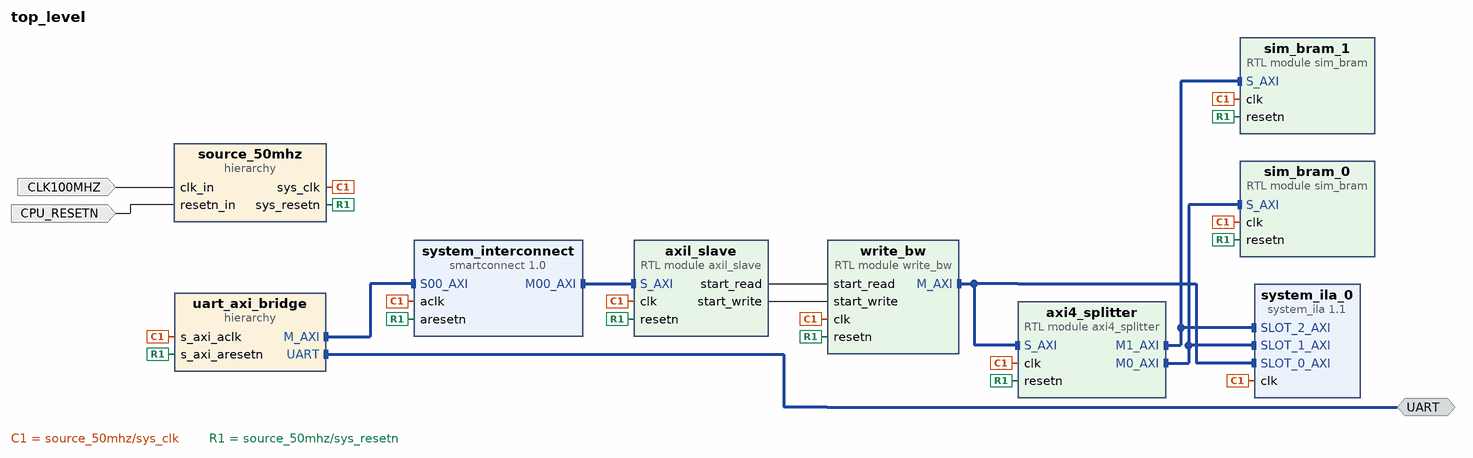
[diagram p0: block diagram of the top level]
# Vivado block design top_level, xc7a100tcsg324-1, Vivado 2021.1
create_bd_design top_level

create_bd_intf_port -mode Master -vlnv xilinx.com:interface:uart_rtl:1.0 UART
create_bd_port -dir I -type clk CLK100MHZ
create_bd_port -dir I -type rst CPU_RESETN

create_bd_cell -type hier source_50mhz
create_bd_cell -type hier uart_axi_bridge
create_bd_cell -type ip -vlnv xilinx.com:ip:smartconnect:1.0 system_interconnect
set_property -dict {CONFIG.NUM_MI 1 CONFIG.NUM_SI 1} [get_bd_cells system_interconnect]
create_bd_cell -type module -reference axil_slave axil_slave
create_bd_cell -type module -reference sim_bram sim_bram_0
set_property -dict {CONFIG.AW 34 CONFIG.DW 256} [get_bd_cells sim_bram_0]
create_bd_cell -type module -reference sim_bram sim_bram_1
set_property -dict {CONFIG.AW 34 CONFIG.DW 256} [get_bd_cells sim_bram_1]
create_bd_cell -type ip -vlnv xilinx.com:ip:system_ila:1.1 system_ila_0
set_property -dict {CONFIG.C_NUM_MONITOR_SLOTS 3} [get_bd_cells system_ila_0]
create_bd_cell -type module -reference write_bw write_bw
create_bd_cell -type module -reference axi4_splitter axi4_splitter
set_property -dict {CONFIG.BASE_ADDR1 0x0000000100000000 CONFIG.ENABLE_WRITE 1} [get_bd_cells axi4_splitter]

# ---- hierarchy /source_50mhz ----
current_bd_instance /source_50mhz
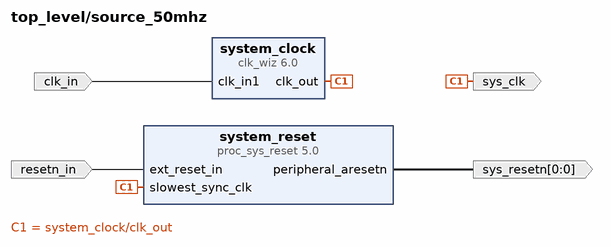
[diagram p1: block diagram inside /source_50mhz]
create_bd_pin -dir I -type clk clk_in
create_bd_pin -dir I -type rst resetn_in
create_bd_pin -dir O -type clk sys_clk
create_bd_pin -dir O -from 0 -to 0 sys_resetn

create_bd_cell -type ip -vlnv xilinx.com:ip:clk_wiz:6.0 system_clock
set_property -dict [list \
  CONFIG.CLKOUT1_JITTER 151.636 \
  CONFIG.CLKOUT1_REQUESTED_OUT_FREQ 50 \
  CONFIG.CLK_OUT1_PORT clk_out \
  CONFIG.MMCM_CLKOUT0_DIVIDE_F 20.000 \
  CONFIG.USE_LOCKED false \
  CONFIG.USE_RESET false \
] [get_bd_cells system_clock]
create_bd_cell -type ip -vlnv xilinx.com:ip:proc_sys_reset:5.0 system_reset

# ---- hierarchy /uart_axi_bridge ----
current_bd_instance /uart_axi_bridge
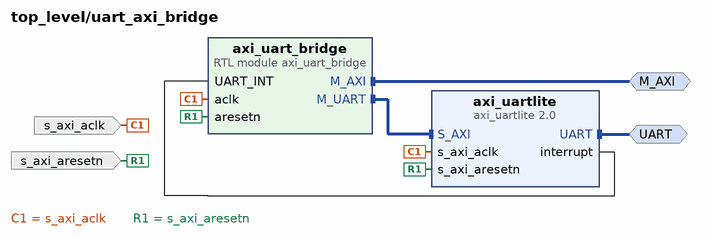
[diagram p2: block diagram inside /uart_axi_bridge]
create_bd_intf_pin -mode Master -vlnv xilinx.com:interface:uart_rtl:1.0 UART
create_bd_intf_pin -mode Master -vlnv xilinx.com:interface:aximm_rtl:1.0 M_AXI
create_bd_pin -dir I -type clk s_axi_aclk
create_bd_pin -dir I -type rst s_axi_aresetn

create_bd_cell -type module -reference axi_uart_bridge axi_uart_bridge
create_bd_cell -type ip -vlnv xilinx.com:ip:axi_uartlite:2.0 axi_uartlite
set_property -dict {CONFIG.C_BAUDRATE 115200} [get_bd_cells axi_uartlite]

# ---- connections ----

current_bd_instance /source_50mhz
connect_bd_net -net clk_in1_0_1 [get_bd_pins clk_in] [get_bd_pins system_clock/clk_in1]
connect_bd_net -net ext_reset_in_0_1 [get_bd_pins resetn_in] [get_bd_pins system_reset/ext_reset_in]
connect_bd_net -net system_clock_clk_100mhz [get_bd_pins system_clock/clk_out] [get_bd_pins sys_clk] [get_bd_pins system_reset/slowest_sync_clk]
connect_bd_net [get_bd_pins system_reset/peripheral_aresetn] [get_bd_pins sys_resetn]

current_bd_instance /uart_axi_bridge
connect_bd_intf_net [get_bd_intf_pins M_AXI] [get_bd_intf_pins axi_uart_bridge/M_AXI]
connect_bd_intf_net [get_bd_intf_pins axi_uart_bridge/M_UART] [get_bd_intf_pins axi_uartlite/S_AXI]
connect_bd_intf_net [get_bd_intf_pins UART] [get_bd_intf_pins axi_uartlite/UART]
connect_bd_net [get_bd_pins axi_uartlite/interrupt] [get_bd_pins axi_uart_bridge/UART_INT]
connect_bd_net -net source_100mhz_sys_clk [get_bd_pins s_axi_aclk] [get_bd_pins axi_uartlite/s_axi_aclk] [get_bd_pins axi_uart_bridge/aclk]
connect_bd_net -net source_100mhz_sys_resetn [get_bd_pins s_axi_aresetn] \
  [get_bd_pins axi_uartlite/s_axi_aresetn] [get_bd_pins axi_uart_bridge/aresetn]

current_bd_instance /
connect_bd_intf_net -intf_net axi4_splitter_0_M0_AXI [get_bd_intf_pins sim_bram_0/S_AXI] [get_bd_intf_pins axi4_splitter/M0_AXI]
connect_bd_intf_net [get_bd_intf_pins sim_bram_0/S_AXI] [get_bd_intf_pins system_ila_0/SLOT_1_AXI]
connect_bd_intf_net -intf_net axi4_splitter_0_M1_AXI [get_bd_intf_pins sim_bram_1/S_AXI] [get_bd_intf_pins axi4_splitter/M1_AXI]
connect_bd_intf_net [get_bd_intf_pins sim_bram_1/S_AXI] [get_bd_intf_pins system_ila_0/SLOT_2_AXI]
connect_bd_intf_net -intf_net axi_uartlite_UART [get_bd_intf_ports UART] [get_bd_intf_pins uart_axi_bridge/UART]
connect_bd_intf_net [get_bd_intf_pins axil_slave/S_AXI] [get_bd_intf_pins system_interconnect/M00_AXI]
connect_bd_intf_net [get_bd_intf_pins uart_axi_bridge/M_AXI] [get_bd_intf_pins system_interconnect/S00_AXI]
connect_bd_intf_net [get_bd_intf_pins write_bw/M_AXI] [get_bd_intf_pins axi4_splitter/S_AXI]
connect_bd_intf_net [get_bd_intf_pins write_bw/M_AXI] [get_bd_intf_pins system_ila_0/SLOT_0_AXI]
connect_bd_net [get_bd_pins axil_slave/start_read] [get_bd_pins write_bw/start_read]
connect_bd_net [get_bd_pins axil_slave/start_write] [get_bd_pins write_bw/start_write]
connect_bd_net -net clk_in1_0_1 [get_bd_ports CLK100MHZ] [get_bd_pins source_50mhz/clk_in]
connect_bd_net -net ext_reset_in_0_1 [get_bd_ports CPU_RESETN] [get_bd_pins source_50mhz/resetn_in]
connect_bd_net -net source_100mhz_sys_clk [get_bd_pins source_50mhz/sys_clk] \
  [get_bd_pins uart_axi_bridge/s_axi_aclk] [get_bd_pins system_interconnect/aclk] [get_bd_pins axil_slave/clk] \
  [get_bd_pins sim_bram_0/clk] [get_bd_pins sim_bram_1/clk] [get_bd_pins system_ila_0/clk] [get_bd_pins write_bw/clk] \
  [get_bd_pins axi4_splitter/clk]
connect_bd_net -net source_100mhz_sys_resetn [get_bd_pins source_50mhz/sys_resetn] \
  [get_bd_pins uart_axi_bridge/s_axi_aresetn] [get_bd_pins system_interconnect/aresetn] [get_bd_pins axil_slave/resetn] \
  [get_bd_pins sim_bram_0/resetn] [get_bd_pins sim_bram_1/resetn] [get_bd_pins write_bw/resetn] \
  [get_bd_pins axi4_splitter/resetn]

# ---- address map ----
assign_bd_address -offset 0x000000000 -range 16G -target_address_space [get_bd_addr_spaces axi4_splitter/M0_AXI] [get_bd_addr_segs sim_bram_0/S_AXI/reg0]
assign_bd_address -offset 0x000000000 -range 16G -target_address_space [get_bd_addr_spaces axi4_splitter/M1_AXI] [get_bd_addr_segs sim_bram_1/S_AXI/reg0]
assign_bd_address -offset 0x0000000000001000 -range 256 -target_address_space [get_bd_addr_spaces uart_axi_bridge/axi_uart_bridge/M_AXI] [get_bd_addr_segs axil_slave/S_AXI/reg0]
assign_bd_address -offset 0x40600000 -range 64K -target_address_space [get_bd_addr_spaces uart_axi_bridge/axi_uart_bridge/M_UART] [get_bd_addr_segs uart_axi_bridge/axi_uartlite/S_AXI/Reg]
assign_bd_address -offset 0x0000000000000000 -range 16E -target_address_space [get_bd_addr_spaces write_bw/M_AXI] [get_bd_addr_segs axi4_splitter/S_AXI/reg0]

validate_bd_design
save_bd_design
